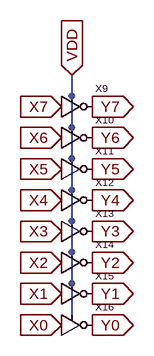
[diagram p0: schematic 8_bit_inverter.asc]
8_bit_inverter.asc, the LTspice schematic file:
Version 4
SHEET 1 1548 3644
WIRE 1152 256 1152 224
WIRE 1152 304 1152 256
WIRE 1152 352 1152 304
WIRE 1152 400 1152 352
WIRE 1152 448 1152 400
WIRE 1152 496 1152 448
WIRE 1152 544 1152 496
WIRE 1152 592 1152 544
FLAG 1152 224 VDD
IOPIN 1152 224 In
FLAG 1136 608 X0
IOPIN 1136 608 In
FLAG 1184 608 Y0
IOPIN 1184 608 Out
FLAG 1136 560 X1
IOPIN 1136 560 In
FLAG 1184 560 Y1
IOPIN 1184 560 Out
FLAG 1136 512 X2
IOPIN 1136 512 In
FLAG 1184 512 Y2
IOPIN 1184 512 Out
FLAG 1136 464 X3
IOPIN 1136 464 In
FLAG 1184 464 Y3
IOPIN 1184 464 Out
FLAG 1136 416 X4
IOPIN 1136 416 In
FLAG 1184 416 Y4
IOPIN 1184 416 Out
FLAG 1136 368 X5
IOPIN 1136 368 In
FLAG 1184 368 Y5
IOPIN 1184 368 Out
FLAG 1136 320 X6
IOPIN 1136 320 In
FLAG 1184 320 Y6
IOPIN 1184 320 Out
FLAG 1136 272 X7
IOPIN 1136 272 In
FLAG 1184 272 Y7
IOPIN 1184 272 Out
SYMBOL inverter 1136 272 R0
SYMATTR InstName X9
SYMBOL inverter 1136 320 R0
SYMATTR InstName X10
SYMBOL inverter 1136 368 R0
SYMATTR InstName X11
SYMBOL inverter 1136 416 R0
SYMATTR InstName X12
SYMBOL inverter 1136 464 R0
SYMATTR InstName X13
SYMBOL inverter 1136 512 R0
SYMATTR InstName X14
SYMBOL inverter 1136 560 R0
SYMATTR InstName X15
SYMBOL inverter 1136 608 R0
SYMATTR InstName X16

The netlist it stands for:
* 8_bit_inverter.asc
XX9 X7 Y7 VDD inverter  ; pins In Out VDD
XX10 X6 Y6 VDD inverter  ; pins In Out VDD
XX11 X5 Y5 VDD inverter  ; pins In Out VDD
XX12 X4 Y4 VDD inverter  ; pins In Out VDD
XX13 X3 Y3 VDD inverter  ; pins In Out VDD
XX14 X2 Y2 VDD inverter  ; pins In Out VDD
XX15 X1 Y1 VDD inverter  ; pins In Out VDD
XX16 X0 Y0 VDD inverter  ; pins In Out VDD
.backanno
.end